# Altium schematic sheet MCU.SchDoc: Top Level
size A3; CompanyName: NOT USED; DocumentNumber: 1; SheetNumber: 1; SheetTotal: 2; PageSetup: Record=PageOptions|CenterHorizontal=True|CenterVertical=True|PrintScale=1.00|XCorrection=1.00|YCorrection=1.00|PrintKind=0|BorderSize=5000000|LeftOffset=0|BottomOffset=0|Orientation=2|PaperLength=1000|PaperWidth=1000|Scale=100|PaperSource=7|PrintQuality=-4|MediaType=1|DitherType=10|PaperKind=A3|PrintScaleMode=0
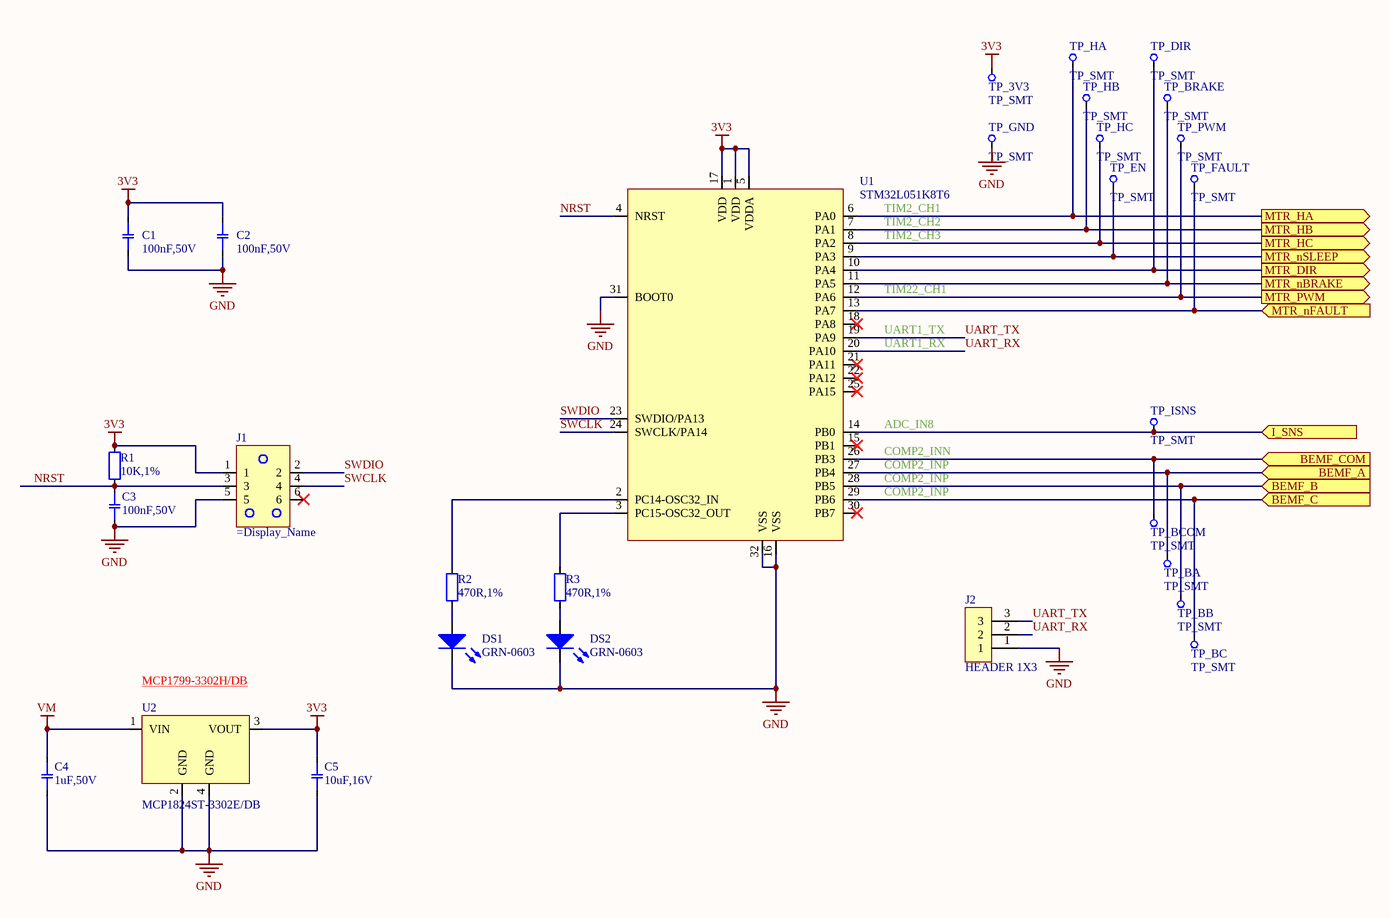
[diagram p0: MCU.SchDoc]

## Parts
C1  100nF,50V  [CAPC1608X09N_0603]
C2  100nF,50V  [CAPC1608X09N_0603]
C3  100nF,50V  [CAPC1608X09N_0603]
C4  1uF,50V  [CAPC1608X09N_0603]
C5  10uF,16V  [CAPC2012X12N_0805]
DS1  GRN-0603  [LED_SML-LX0603]
DS2  GRN-0603  [LED_SML-LX0603]
J1  (no value)  [TAG-CONNECT_TC2030-IDC]  (no BOM)
J2  HEADER 1X3  [HIROSE_A2-3PA-2.54DSA]
R1  10K,1%  [RESC1608X06N_0603]
R2  470R,1%  [RESC1608X06N_0603]
R3  470R,1%  [RESC1608X06N_0603]
TP_3V3  TP_SMT  [TP_100X200]
TP_BA  TP_SMT  [TP_100X200]
TP_BB  TP_SMT  [TP_100X200]
TP_BC  TP_SMT  [TP_100X200]
TP_BCOM  TP_SMT  [TP_100X200]
TP_BRAKE  TP_SMT  [TP_100X200]
TP_DIR  TP_SMT  [TP_100X200]
TP_EN  TP_SMT  [TP_100X200]
TP_FAULT  TP_SMT  [TP_100X200]
TP_GND  TP_SMT  [TP_100X200]
TP_HA  TP_SMT  [TP_100X200]
TP_HB  TP_SMT  [TP_100X200]
TP_HC  TP_SMT  [TP_100X200]
TP_ISNS  TP_SMT  [TP_100X200]
TP_PWM  TP_SMT  [TP_100X200]
U1  STM32L051K8T6  [LQFP32]
U2  MCP1824ST-3302E/DB  [SOT230P700X180-4N_SOT223-3]

## Ports
BEMF_A (in), BEMF_B (in), BEMF_C (in), BEMF_COM (in), I_SNS (in), MTR_DIR (out), MTR_HA (out), MTR_HB (out), MTR_HC (out), MTR_nBRAKE (out), MTR_nFAULT (in), MTR_nSLEEP (out), MTR_PWM (out)

## Nets
3V3: C1.2 C2.2 C5.2 J1.1 R1.2 TP_3V3.1 U1.1(VDD) U1.5(VDDA) U1.17(VDD) U2.3(VOUT)
GND: C1.1 C2.1 C3.2 C4.1 C5.1 DS1.1(C) DS2.1(C) J1.5 J2.1 TP_GND.1 U1.16(VSS) U1.31(BOOT0) U1.32(VSS) U2.2(GND) U2.4(GND)
VM: C4.2 U2.1(VIN)
BEMF_A: TP_BA.1 U1.27(PB4) ; port BEMF_A
BEMF_B: TP_BB.1 U1.28(PB5) ; port BEMF_B
BEMF_C: TP_BC.1 U1.29(PB6) ; port BEMF_C
BEMF_COM: TP_BCOM.1 U1.26(PB3) ; port BEMF_COM
I_SNS: TP_ISNS.1 U1.14(PB0) ; port I_SNS
MTR_DIR: TP_DIR.1 U1.10(PA4) ; port MTR_DIR
MTR_HA: TP_HA.1 U1.6(PA0) ; port MTR_HA
MTR_HB: TP_HB.1 U1.7(PA1) ; port MTR_HB
MTR_HC: TP_HC.1 U1.8(PA2) ; port MTR_HC
MTR_nBRAKE: TP_BRAKE.1 U1.11(PA5) ; port MTR_nBRAKE
MTR_nFAULT: TP_FAULT.1 U1.13(PA7) ; port MTR_nFAULT
MTR_nSLEEP: TP_EN.1 U1.9(PA3) ; port MTR_nSLEEP
MTR_PWM: TP_PWM.1 U1.12(PA6) ; port MTR_PWM
NRST: C3.1 J1.3 R1.1 U1.4(NRST)
SWCLK: J1.4 U1.24(SWCLK/PA14)
SWDIO: J1.2 U1.23(SWDIO/PA13)
UART_RX: J2.2 U1.20(PA10)
UART_TX: J2.3 U1.19(PA9)
NetDS1_2: DS1.2(A) R2.1
NetDS2_2: DS2.2(A) R3.1
NetR2_2: R2.2 U1.2(PC14-OSC32_IN)
NetR3_2: R3.2 U1.3(PC15-OSC32_OUT)

Not connected (* = marked no-connect by the designer): J1 6*; U1 15(PB1)* 18(PA8)* 21(PA11)* 22(PA12)* 25(PA15)* 30(PB7)*

## Notes on the sheet
- (near U1) TIM2_CH1
- (near U1) TIM2_CH2
- (near U1) TIM2_CH3
- (near U1) TIM22_CH1
- (near U1) UART1_TX
- (near U1) UART1_RX
- (near U1) COMP2_INN
- (near U1) ADC_IN8
- (near U1) COMP2_INP
- (near U2) MCP1799-3302H/DB <https://www.digikey.co.nz/product-detail/en/microchip-technology/MCP1799-3302H-DB/150-MCP1799-3302H-DB-ND/10491984>
- Project
- Size:
- Date:
- A3
- Revision:
- Sheet
- of
- Lambo
- File:

## Library data of the parts
C1-C3 = CCH-104CH-G: CAP CER 0.1UF 50V 10% X7R 0603; Manufacturer: Kemet; Manufacturer Part Number: C0603C104K5RACTU; Type: Ceramic; Display_Name: 100nF,50V; Capacitance: 100nF; Dielectric: X7R; Tolerance: 10%; Voltage: 50V; BWA PN: CCH-104CH-G; Schematic Symbol: CAP-NP_1; Supplier 1: Digi-Key; Supplier Part Number 1: 399-5089-1-ND
C4 = CCH-106DH-G-A: AUTOMOTIVE CAP CER 1UF 50V 10% X5R 0603; Manufacturer: TDK Corporation; Manufacturer Part Number: CGA3E3X5R1H105K080AB; Type: Ceramic; Display_Name: 1uF,50V; Capacitance: 1uF; Dielectric: X5R; Tolerance: 10%; Voltage: 50V; BWA PN: CCH-106DH-G-A; Schematic Symbol: CAP-NP_1; Supplier 1: Digi-Key; Supplier Part Number 1: 445-7878-1-ND
C5 = CCI-106CE-G: CAP CER 10µF ±10% 16V X7R 0805; Manufacturer: Samsung Electro-Mechanics America, Inc.; Manufacturer Part Number: CL21B106KOQNNNG; Type: Ceramic; Display_Name: 10uF,16V; Capacitance: 10uF; Dielectric: X7R; Tolerance: 10%; Voltage: 16V; BWA PN: CCI-106CE-G; Schematic Symbol: CAP-NP_1; Supplier 1: Digi-Key; Supplier Part Number 1: 1276-6472-1-ND
DS1 DS2 = LED-10087-A: LED GREEN CLEAR 0603 SMD; Manufacturer: Dialight; Manufacturer Part Number: 5988081107F; Wavelength: 523nm; Axial Intensity: 300mcd; If(max): 20mA; Lens Style/Size: 0603; Vf@I: 3.2V; Viewing Angle: 140; Display_Name: GRN-0603; BWA PN: LED-10087-A; Colour: GREEN; Lens type: clear; Vr(max): -; Schematic Symbol: LED_1; Supplier 1: Digi-Key; Supplier Part Number 1: 350-2036-1-ND
J1 = NONPART-051: Tag connect 6 way; Schematic Symbol: TAGCON_TC2030-IDC; BWA PN: NONPART-051
J2 = CON-10038-A: CONN 3-pin 2.54mm pitch TH single row; Manufacturer: Hirose; Manufacturer Part Number: A2-3PA-2.54DSA; Contacts: 3; Rows: 1; Display_Name: HEADER 1X3; Pitch: 2.54mm; Type: HEADER; BWA PN: CON-10038-A; Schematic Symbol: HIROSE_A2-3PA-2.54DSA
R1 = RSH-10K00-D: RES 10.0K OHM 1/10W 1% 0603 SMD; Manufacturer: Yageo; Manufacturer Part Number: RC0603FR-0710KL; Power: 0.1W; Display_Name: 10K,1%; Resistance: 10K; Tolerance: 1%; Type: Chip; BWA PN: RSH-10K00-D; Schematic Symbol: RESISTOR_1; Supplier 1: Digi-Key; Supplier Part Number 1: 311-10.0KHRCT-ND
R2 R3 = RSH-470R0-D: RES 470 OHM 1/10W 1% 0603 SMD; Manufacturer: Rohm Semiconductor; Manufacturer Part Number: MCR03EZPFX4700; Power: 0.1W; Display_Name: 470R,1%; Resistance: 470R; Tolerance: 1%; Type: Chip; BWA PN: RSH-470R0-D; Schematic Symbol: RESISTOR_1; Supplier 1: Digi-Key; Supplier Part Number 1: RHM470HCT-ND
TP_3V3 TP_BA TP_BB TP_BC TP_BCOM TP_BRAKE TP_DIR TP_EN TP_FAULT TP_GND TP_HA TP_HB TP_HC TP_ISNS TP_PWM = NONPART-060: Test Point - SMT; Display_Name: TP_SMT; BWA PN: NONPART-060; Schematic Symbol: TP_1
U1 = ICT-10696-A: 32 Bit Mcirocontroler; Manufacturer: ST Microelectronics; Temp Range: -40°C ~ 85°C; Display_Name: STM32L051K8T6; BWA PN: ICT-10696-A; Schematic Symbol: STM32L051x6/8; Manufacturer Part Number: STM32L051K8T6; Supplier 1: Digi-Key; Supplier Part Number 1: 497-14901-ND
U2 = ICT-10417-A: IC LDO REG 300MA 3.3V SOT223-3; Manufacturer: Microchip Technology; Temp Range: -40°C ~ 125°C; Display_Name: MCP1824ST-3302E/DB; BWA PN: ICT-10417-A; Schematic Symbol: MCP1824ST_DB; Manufacturer Part Number: MCP1824ST-3302E/DB; Supplier 1: Digi-Key; Supplier Part Number 1: MCP1824ST-3302E/DBCT-ND